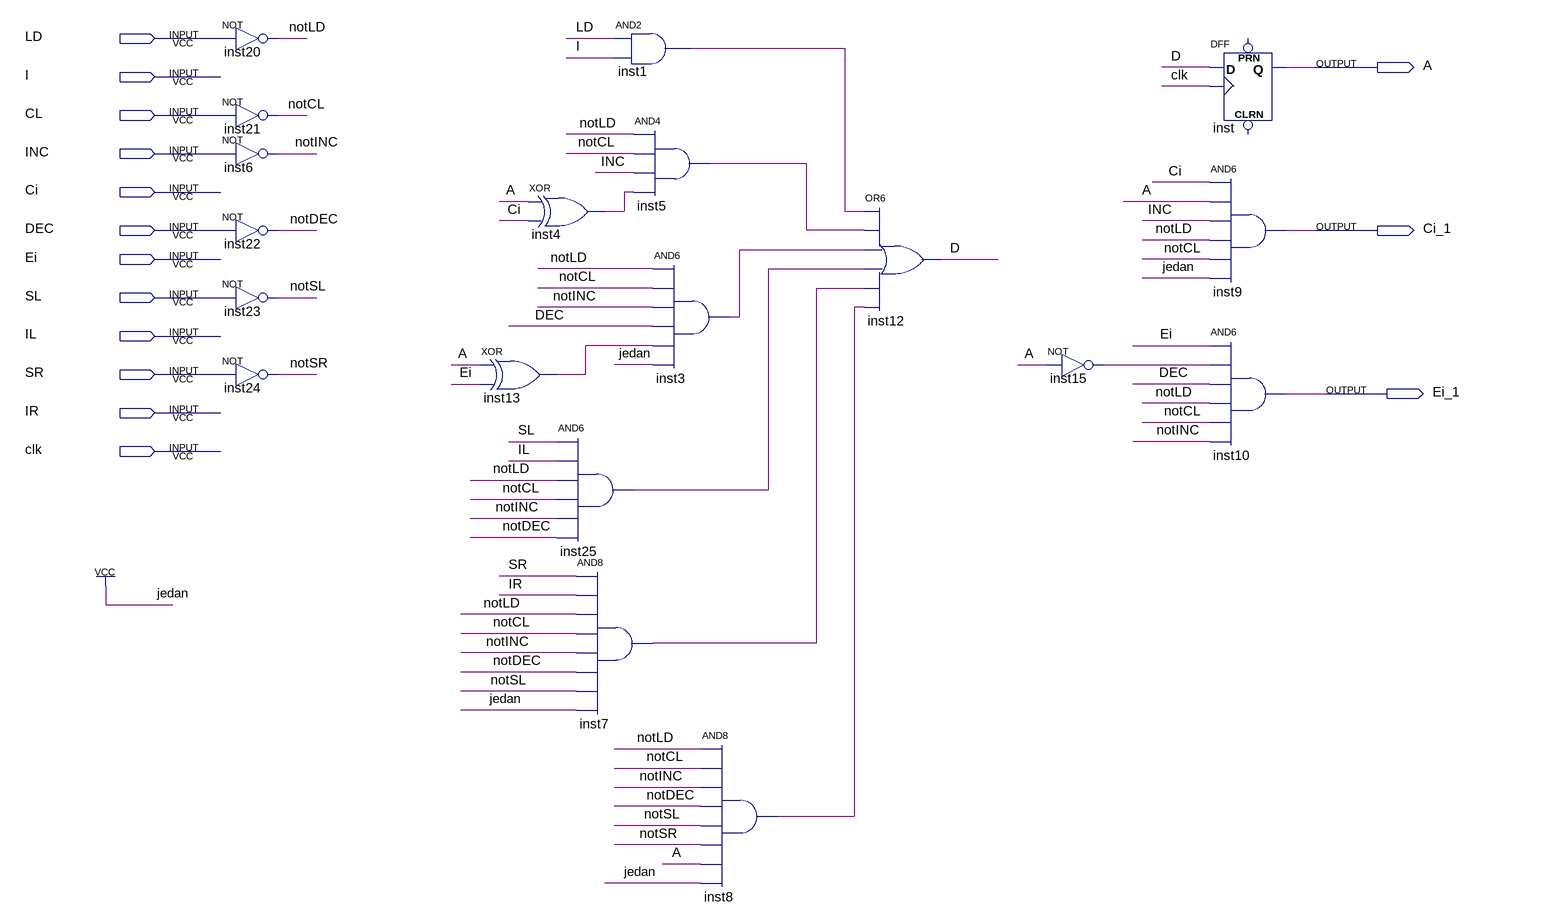
[diagram p0: schematic sheet]
// Quartus schematic REG1_LD_CL_INC_DEC_SL_SR.bdf as structural Verilog: 19 symbols, 15 pins
module REG1_LD_CL_INC_DEC_SL_SR (
  input  LD,
  input  I,
  input  CL,
  input  INC,
  input  Ci,
  input  DEC,
  input  Ei,
  input  SL,
  input  IL,
  input  SR,
  input  IR,
  input  clk,
  output A,
  output Ci_1,
  output Ei_1
);

  wire D, inst1_out, inst3_out, inst4_out, inst5_out, inst7_out, inst8_out, inst13_out, inst15_out,
       inst25_out, notCL, notDEC, notINC, notLD, notSL, notSR;

  not inst20 (notLD, LD);
  not inst21 (notCL, CL);
  not inst6 (notINC, INC);
  not inst22 (notDEC, DEC);
  not inst23 (notSL, SL);
  not inst24 (notSR, SR);
  xor inst13 (inst13_out, A, Ei);
  xor inst4 (inst4_out, A, Ci);
  and inst25 (inst25_out, SL, IL, notLD, notCL, notINC, notDEC);
  and inst1 (inst1_out, LD, I);
  and inst5 (inst5_out, notLD, notCL, INC, inst4_out);
  and inst7 (inst7_out, SR, IR, notLD, notCL, notINC, notDEC, notSL, 1'b1);
  and inst3 (inst3_out, notLD, notCL, notINC, DEC, inst13_out, 1'b1);
  and inst8 (inst8_out, notLD, notCL, notINC, notDEC, notSL, notSR, A, 1'b1);
  or inst12 (D, inst1_out, inst5_out, inst3_out, inst25_out, inst7_out, inst8_out);
  not inst15 (inst15_out, A);
  DFF inst (.CLK(clk), .D(D), .Q(A));  // open: CLRN, PRN
  and inst9 (Ci_1, Ci, A, INC, notLD, notCL, 1'b1);
  and inst10 (Ei_1, Ei, inst15_out, DEC, notLD, notCL, notINC);
endmodule
